# Altium schematic sheet TPCapTH.SchDoc
size A; SheetNumber: 1; SheetTotal: 1
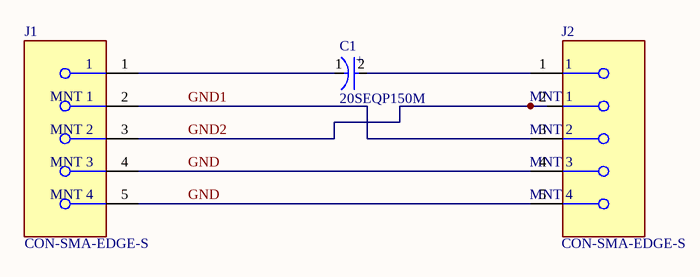
[diagram p0: TPCapTH.SchDoc]

## Parts
C1  20SEQP150M  [FP-OS-CON-TH-F13-d_0_6-MFG]
J1  CON-SMA-EDGE-S  [FP-CON-SMA-EDGE-S-MFG]
J2  CON-SMA-EDGE-S  [FP-CON-SMA-EDGE-S-MFG]

## Nets
GND: J1.4(MNT_3) J1.5(MNT_4) J2.4(MNT_3) J2.5(MNT_4)
GND1: J1.2(MNT_1) J2.3(MNT_2)
GND2: J1.3(MNT_2) J2.2(MNT_1)
NetC1_1: C1.1(C) J1.1
NetC1_2: C1.2(A) J2.1

## Notes on the sheet
- (in symbol CMP-05428-000819-1) +

## Library data of the parts
C1 = CMP-05428-000819-1: Conductive Polymer Aluminum Solid Capacitors (OS-CON) 150uF ±20% 20V RADIAL TH 10x13mm; ESR (Equivalent Series Resistance): 20mR; Ripple Current: 4.32A; Polarity: Polar; Life (Hours): 1000Hour; Dissipation Factor: 15%; Voltage Rating (DC): 20V; Case/Package: Radial; Min Operating Temperature: -55°C; Voltage Rating: 20V; Packaging: Bulk; Capacitance: 150uF; Height - Seated (Max): 0.512inch; Package Quantity: 200; Termination: Radial; Mount: Through Hole; Series: OS-CON™, SEQP; Lead Free: Lead Free; Lead Pitch: 0.197inch; Max Operating Temperature: 125°C; RoHS Compliant: Yes; REACH SVHC: No SVHC; Diameter: 10mm; Length: 13mm; Tolerance: 20%
J1 J2 = CMP-204357-000001-1: CONN SMA JACK STR EDGE MNT; Manufacturer: RF Solutions Ltd.; Impedance: 50Ω; Conn Orientation: Right Angle; Is Female: yes; Number Of Contacts: 1; Frequency: 18GHz; Shielding: true; Category: Conn; ComponentLink2URL: https://www.rfsolutions.co.uk/downloads/1498648656DS-CON-EDGE-SMA-4.pdf; Octopart: https://octopart.com/con-sma-edge-s-rf+solutions-70967450; Package: CONN_JACK; Manufacturer Part Number: CON-SMA-EDGE-S; Height: 6.35mm; Device Class L1: Connectors; Footprint Url: https://forum.upverter.com/uploads/default/original/3X/b/e/be75b907af57498775929d6d9099689c472e0307.pdf; Contact Material: Gold; ComponentLink2Description: Datasheet; Device Class L2: RF / Coaxial Connectors; RoHS: TRUE; Device Class L3: unset; Digikey Description: CONN SMA JACK STR EDGE MNT; Lead Free: Yes; Automotive: No